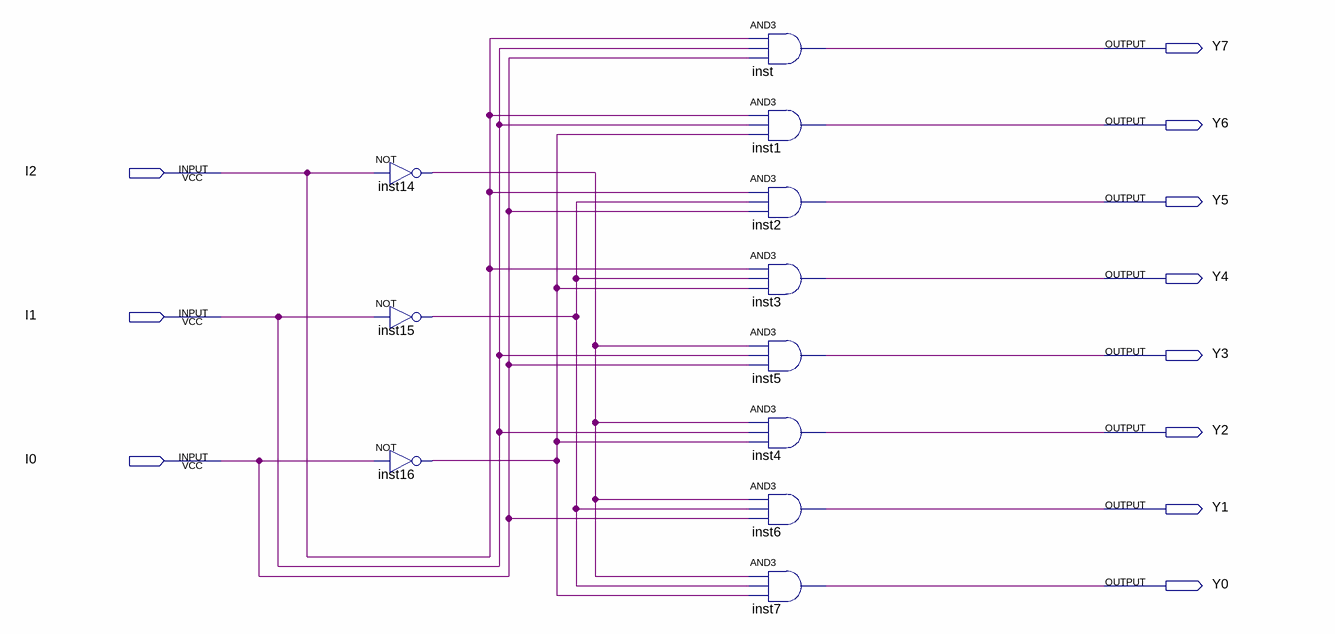
[diagram p0: schematic sheet]
// Quartus schematic decoder3_8.bdf as structural Verilog: 11 symbols, 11 pins
module decoder3_8 (
  input  I2,
  input  I1,
  input  I0,
  output Y7,
  output Y6,
  output Y5,
  output Y4,
  output Y3,
  output Y2,
  output Y1,
  output Y0
);

  wire inst14_out, inst15_out, inst16_out;

  not inst14 (inst14_out, I2);
  not inst15 (inst15_out, I1);
  not inst16 (inst16_out, I0);
  and inst (Y7, I2, I1, I0);
  and inst1 (Y6, I2, I1, inst16_out);
  and inst2 (Y5, I2, inst15_out, I0);
  and inst3 (Y4, I2, inst15_out, inst16_out);
  and inst5 (Y3, inst14_out, I1, I0);
  and inst4 (Y2, inst14_out, I1, inst16_out);
  and inst6 (Y1, inst14_out, inst15_out, I0);
  and inst7 (Y0, inst14_out, inst15_out, inst16_out);
endmodule
